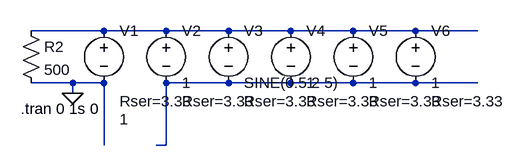
[diagram p0: schematic leakage.asc]
leakage.asc, the LTspice schematic file:
Version 4
SHEET 1 880 680
WIRE 176 64 64 64
WIRE 272 64 176 64
WIRE 368 64 272 64
WIRE 464 64 368 64
WIRE 560 64 464 64
WIRE 656 64 560 64
WIRE 752 64 656 64
WIRE 128 144 64 144
WIRE 176 144 128 144
WIRE 368 144 272 144
WIRE 464 144 368 144
WIRE 560 144 464 144
WIRE 656 144 560 144
WIRE 752 144 656 144
WIRE 128 160 128 144
WIRE 176 240 176 144
WIRE 272 240 272 144
WIRE 272 240 256 240
FLAG 128 160 0
SYMBOL voltage 176 48 R0
WINDOW 3 24 152 Left 2
WINDOW 123 0 0 Left 0
WINDOW 39 24 124 Left 2
SYMATTR Value 1
SYMATTR SpiceLine Rser=3.33
SYMATTR InstName V1
SYMBOL voltage 272 48 R0
WINDOW 123 0 0 Left 0
WINDOW 39 24 124 Left 2
SYMATTR SpiceLine Rser=3.33
SYMATTR InstName V2
SYMATTR Value 1
SYMBOL voltage 368 48 R0
WINDOW 123 0 0 Left 0
WINDOW 39 24 124 Left 2
SYMATTR SpiceLine Rser=3.33
SYMATTR InstName V3
SYMATTR Value SINE(0.5 2 5)
SYMBOL voltage 464 48 R0
WINDOW 123 0 0 Left 0
WINDOW 39 24 124 Left 2
SYMATTR SpiceLine Rser=3.33
SYMATTR InstName V4
SYMATTR Value 1
SYMBOL voltage 560 48 R0
WINDOW 123 0 0 Left 0
WINDOW 39 24 124 Left 2
SYMATTR SpiceLine Rser=3.33
SYMATTR InstName V5
SYMATTR Value 1
SYMBOL voltage 656 48 R0
WINDOW 123 0 0 Left 0
WINDOW 39 24 124 Left 2
SYMATTR SpiceLine Rser=3.33
SYMATTR InstName V6
SYMATTR Value 1
SYMBOL res 48 48 R0
SYMATTR InstName R2
SYMATTR Value 500
TEXT 48 184 Left 2 !.tran 0 1s 0

The netlist it stands for:
* leakage.asc
V1 N001 0 1 Rser=3.33
V2 N001 N002 1 Rser=3.33
V3 N001 N002 SINE(0.5 2 5) Rser=3.33
V4 N001 N002 1 Rser=3.33
V5 N001 N002 1 Rser=3.33
V6 N001 N002 1 Rser=3.33
R2 N001 0 500
.tran 0 1s 0
.backanno
.end